# EAGLE design Panda (EAGLE 9.2.2)
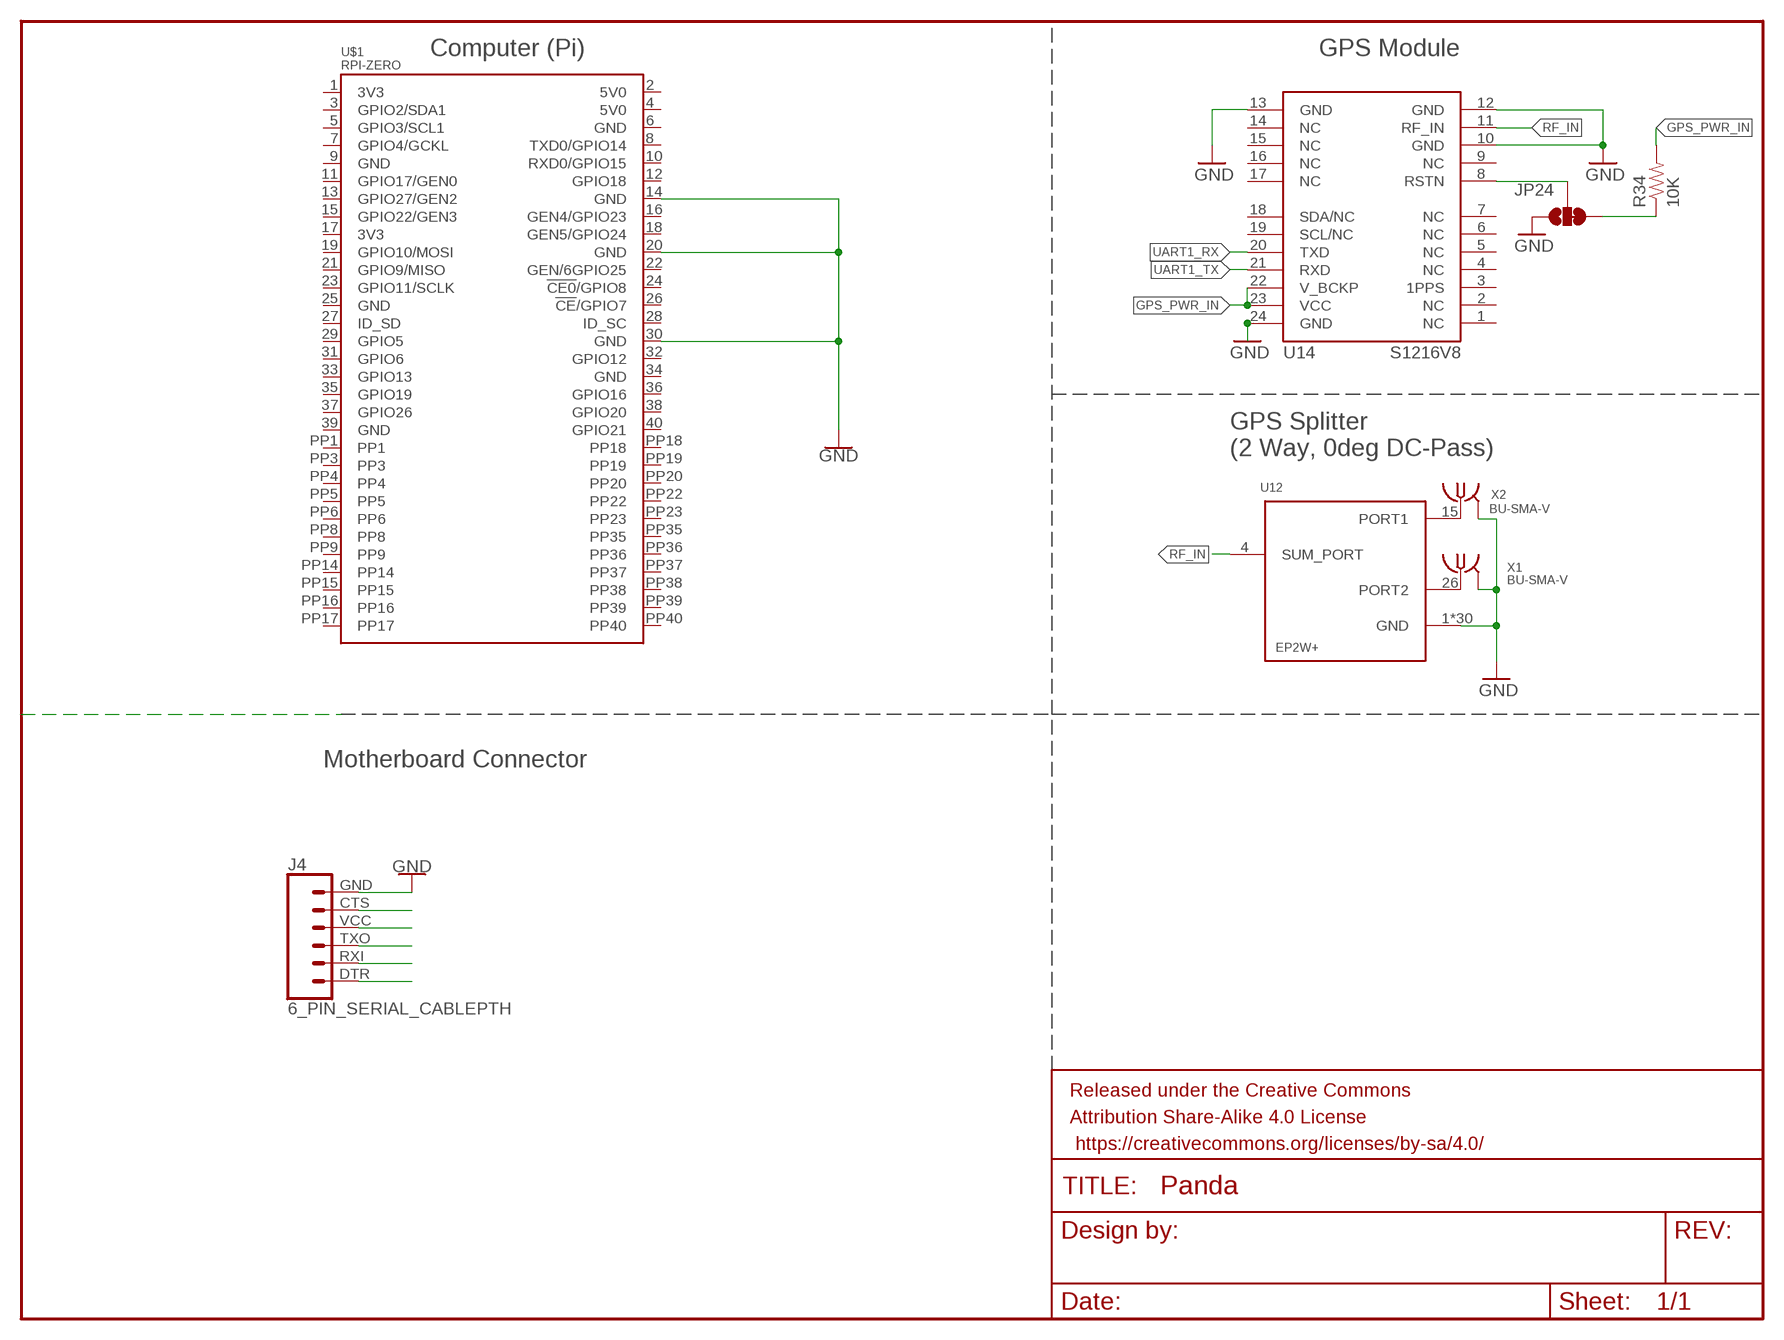
[diagram p0: schematic, sheet 1]

## Parts
FRAME2  FRAME-LETTER  [CREATIVE_COMMONS]
J4  6_PIN_SERIAL_CABLEPTH  [FTDI_BASIC]
JP24  JUMPER-PAD-3-2OF3_NC_BY_TRACE_SMALL  [PAD-JUMPER-3-2OF3_NC_BY_TRACE_YES_SILK_FULL_BOX]
R34  10K  10KOHM-1/10W-1%(0603)0603  [0603-RES]
U12  EP2W+  [QFN32-5X5MM]
U14  S1216V8  [S1216_24PIN_PACKAGE]
U$1  RPI-ZERO  [RASP_PI_ZERO_BOARD_FULL]
X1  BU-SMA-V  [BU-SMA-V]
X2  BU-SMA-V  [BU-SMA-V]

## Nets
GND: J4.GND JP24.1 U12.1(GND) U12.2(GND) U12.3(GND) U12.5(GND) U12.6(GND) U12.7(GND) U12.8(GND) U12.9(GND) U12.10(GND) U12.11(GND) U12.12(GND) U12.13(GND) U12.14(GND) U12.16(GND) U12.17(GND) U12.18(GND) U12.19(GND) U12.20(GND) U12.21(GND) U12.22(GND) U12.23(GND) U12.24(GND) U12.25(GND) U12.27(GND) U12.28(GND) U12.29(GND) U12.30(GND) U12.31(GND) U12.32(GND) U12.EP(GND) U14.10(GND) U14.12(GND) U14.13(GND) U14.24(GND) X1.2 X1.3 X1.4 X1.5 X2.2 X2.3 X2.4 X2.5
GND@6: U$1.14(GND) U$1.20(GND) U$1.30(GND) ; supply symbol labelled GND
GPS_PWR_IN: R34.2 U14.22(V_BCKP) U14.23(VCC)
N$2: J4.CTS
N$3: J4.VCC
N$4: J4.TXO
N$6: J4.RXI
N$7: J4.DTR
N$9: JP24.2 U14.8(RSTN)
N$16: U12.15(PORT1) X2.1
N$17: U12.26(PORT2) X1.1
N$24: JP24.3 R34.1
RF_IN: U12.4(SUM_PORT) U14.11(RF_IN)
UART1_RX: U14.20(TXD)
UART1_TX: U14.21(RXD)
Unconnected: U14.1(NC) U14.2(NC) U14.3(1PPS) U14.4(NC) U14.5(NC) U14.6(NC) U14.7(NC) U14.9(NC) U14.14(NC) U14.15(NC) U14.16(NC) U14.17(NC) U14.18(SDA/NC) U14.19(SCL/NC) U$1.1(3V3) U$1.2(5V0) U$1.3(GPIO2/SDA1) U$1.4(5V0) U$1.5(GPIO3/SCL1) U$1.6(GND) U$1.7(GPIO4/GCKL) U$1.8(TXD0/GPIO14) U$1.9(GND) U$1.10(RXD0/GPIO15) U$1.11(GPIO17/GEN0) U$1.12(GPIO18) U$1.13(GPIO27/GEN2) U$1.15(GPIO22/GEN3) U$1.16(GEN4/GPIO23) U$1.17(3V3) U$1.18(GEN5/GPIO24) U$1.19(GPIO10/MOSI) U$1.21(GPIO9/MISO) U$1.22(GEN/6GPIO25) U$1.23(GPIO11/SCLK) U$1.24(!CE0!/GPIO8) U$1.25(GND) U$1.26(!CE!/GPIO7) U$1.27(ID_SD) U$1.28(ID_SC) U$1.29(GPIO5) U$1.31(GPIO6) U$1.32(GPIO12) U$1.33(GPIO13) U$1.34(GND) U$1.35(GPIO19) U$1.36(GPIO16) U$1.37(GPIO26) U$1.38(GPIO20) U$1.39(GND) U$1.40(GPIO21) U$1.PP1 U$1.PP3 U$1.PP4 U$1.PP5 U$1.PP6 U$1.PP8 U$1.PP9 U$1.PP14 U$1.PP15 U$1.PP16 U$1.PP17 U$1.PP18 U$1.PP19 U$1.PP20 U$1.PP22 U$1.PP23 U$1.PP35 U$1.PP36 U$1.PP37 U$1.PP38 U$1.PP39 U$1.PP40

## Notes on the sheet
- Computer (Pi) | GPS Module
- GPS Splitter 
  (2 Way, 0deg DC-Pass)
- Motherboard Connector
- Modifications are currently needed
  to the module for radiation tolerance

## Library data of the parts
FRAME2 = SparkFun-Aesthetics:FRAME-LETTER: Schematic Frame - Letter Standard 8.5x11 US Letter frame
J4 = SparkFun-Connectors:6_PIN_SERIAL_CABLE: 6-pin header connection for use with the "FTDI BASIC" pinout - CABLE SIDE. Also known as "Arduino Serial Program Header". This is used on a design to provide a 6-pin connection point for serial communication usually from a USB cable (D+/D-) to these headers (RX/TX). It also has the remaining pins necessary for programming in the Arduino evironment (DTR, GND, and sometimes VCC). Note, this device has "CABLE" in the name. It is intended to be used on a design that usually lives on the end of your USB cable and prvides the converter chip (FTDI232 or FTDI231x) to commnicate serial RX/TX. The "sister" device, named "TARGET" is inteneded to be used on a design that contains a target micro-controller that you wish to program. You can populate with some of these: Female Headers <https://www.sparkfun.com/products/115> (PRT-00115) For reference (or to suit your programming needs) check out these designs: SparkFun FTDI Basic Breakout - 5V <https://www.sparkfun.com/products/9716> (DEV-09716) SparkFun FTDI Basic Breakout - 3.3V <https://www.sparkfun.com/products/9873> (DEV-09873) SparkFun FTDI SmartBasic <https://www.sparkfun.com/products/12935> (DEV-12935) SparkFun Beefy 3 - FTDI Basic Breakout <https://www.sparkfun.com/products/13746> (DEV-13746)
JP24 = SparkFun-Passives:JUMPER-PAD-3-2OF3_NC_BY_TRACE
R34 = SparkFun-Resistors:10KOHM-1/10W-1%(0603): RES-00824; PROD_ID: RES-00824
U12 = maholli:EP2W+
U14 = maholli:S1216V8
U$1 = rpi-zero:RPI-ZERO
X1 X2 = con-coax:BU-SMA-V: FEMALE SMA CONNECTOR Radiall distributor RS 112-3794; OC_FARNELL: unknown; OC_NEWARK: unknown

## Net classes
0 default: width 0.272 mm, drill 0.381 mm, clearance 0.127 mm

## Board
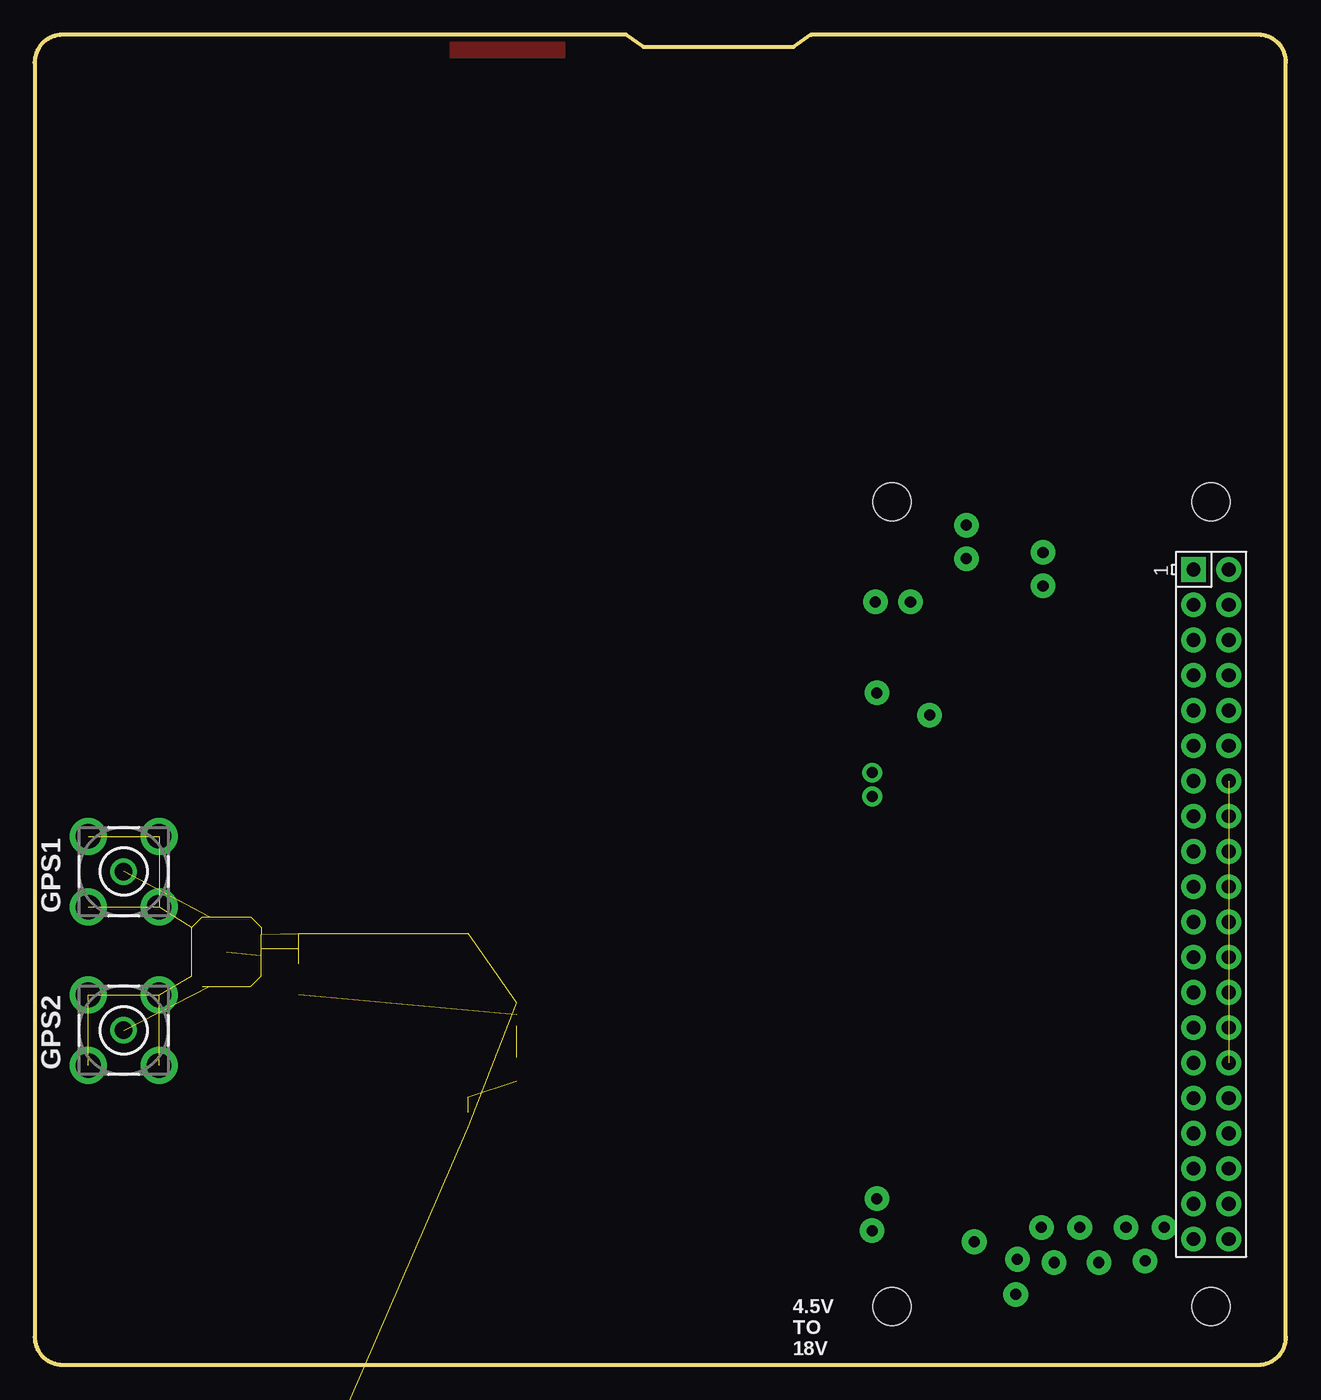
[diagram p1: board, top side]
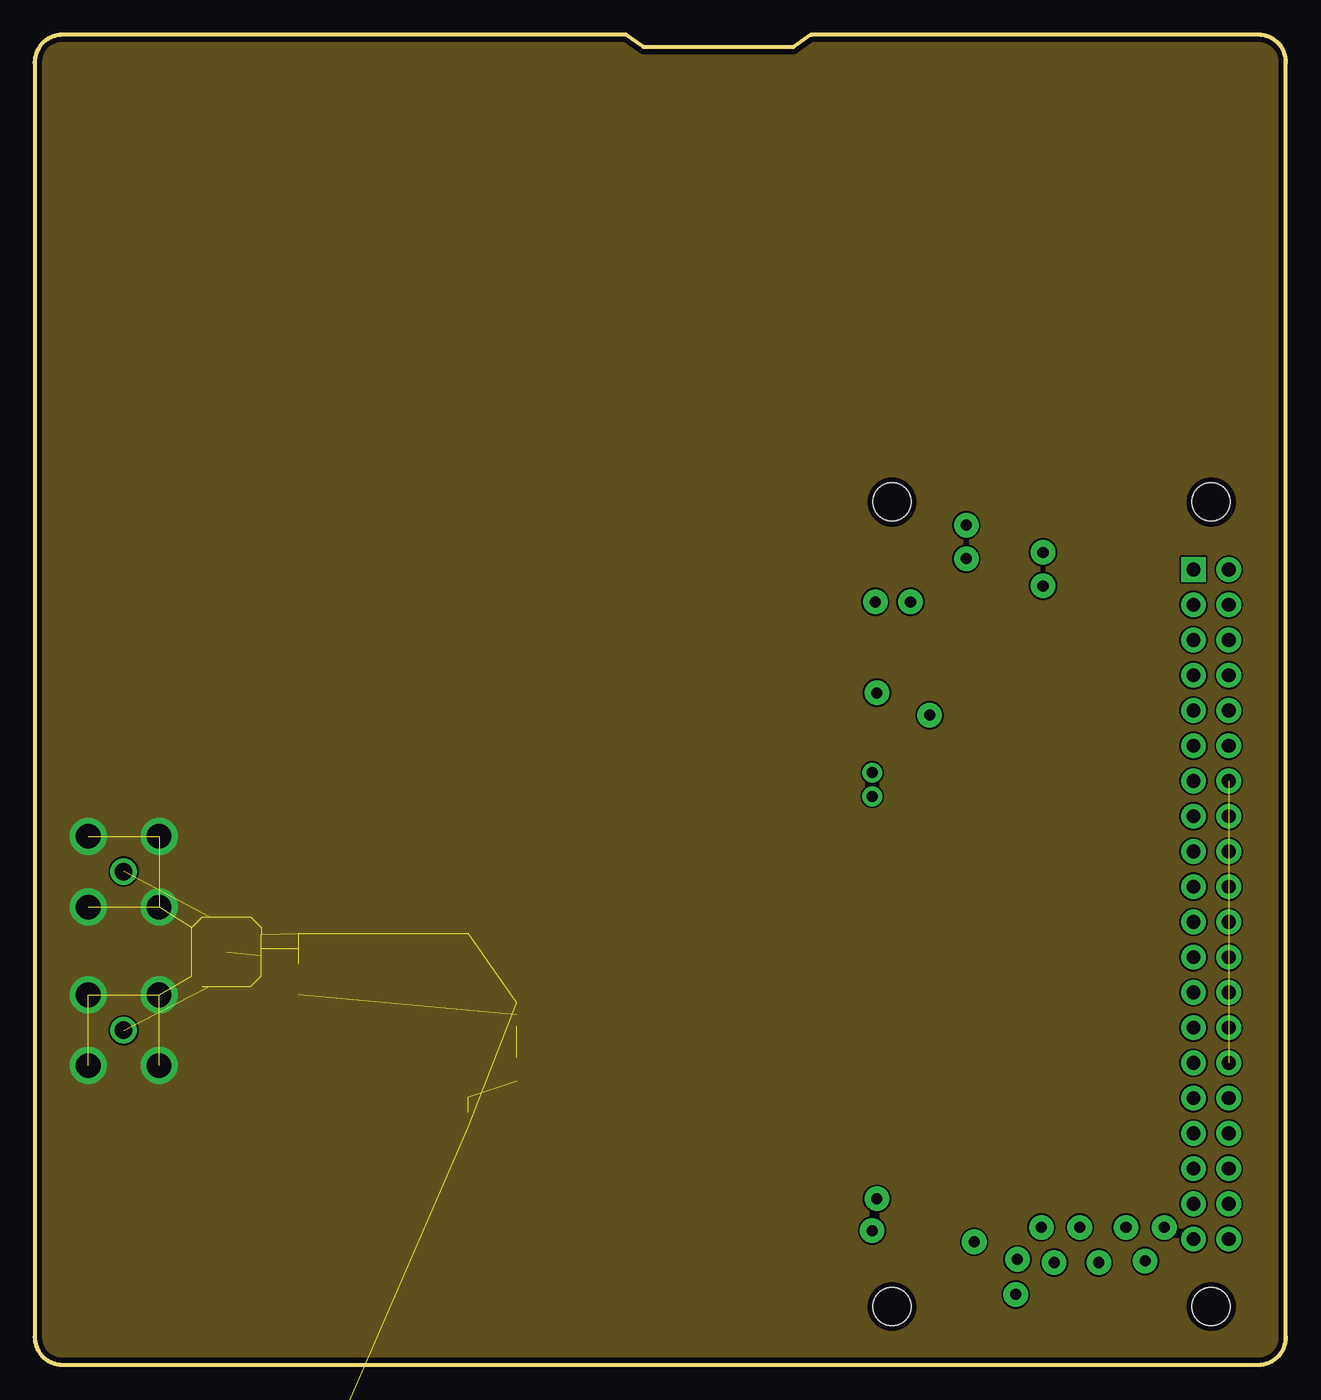
[diagram p2: board, inner layer Route2]
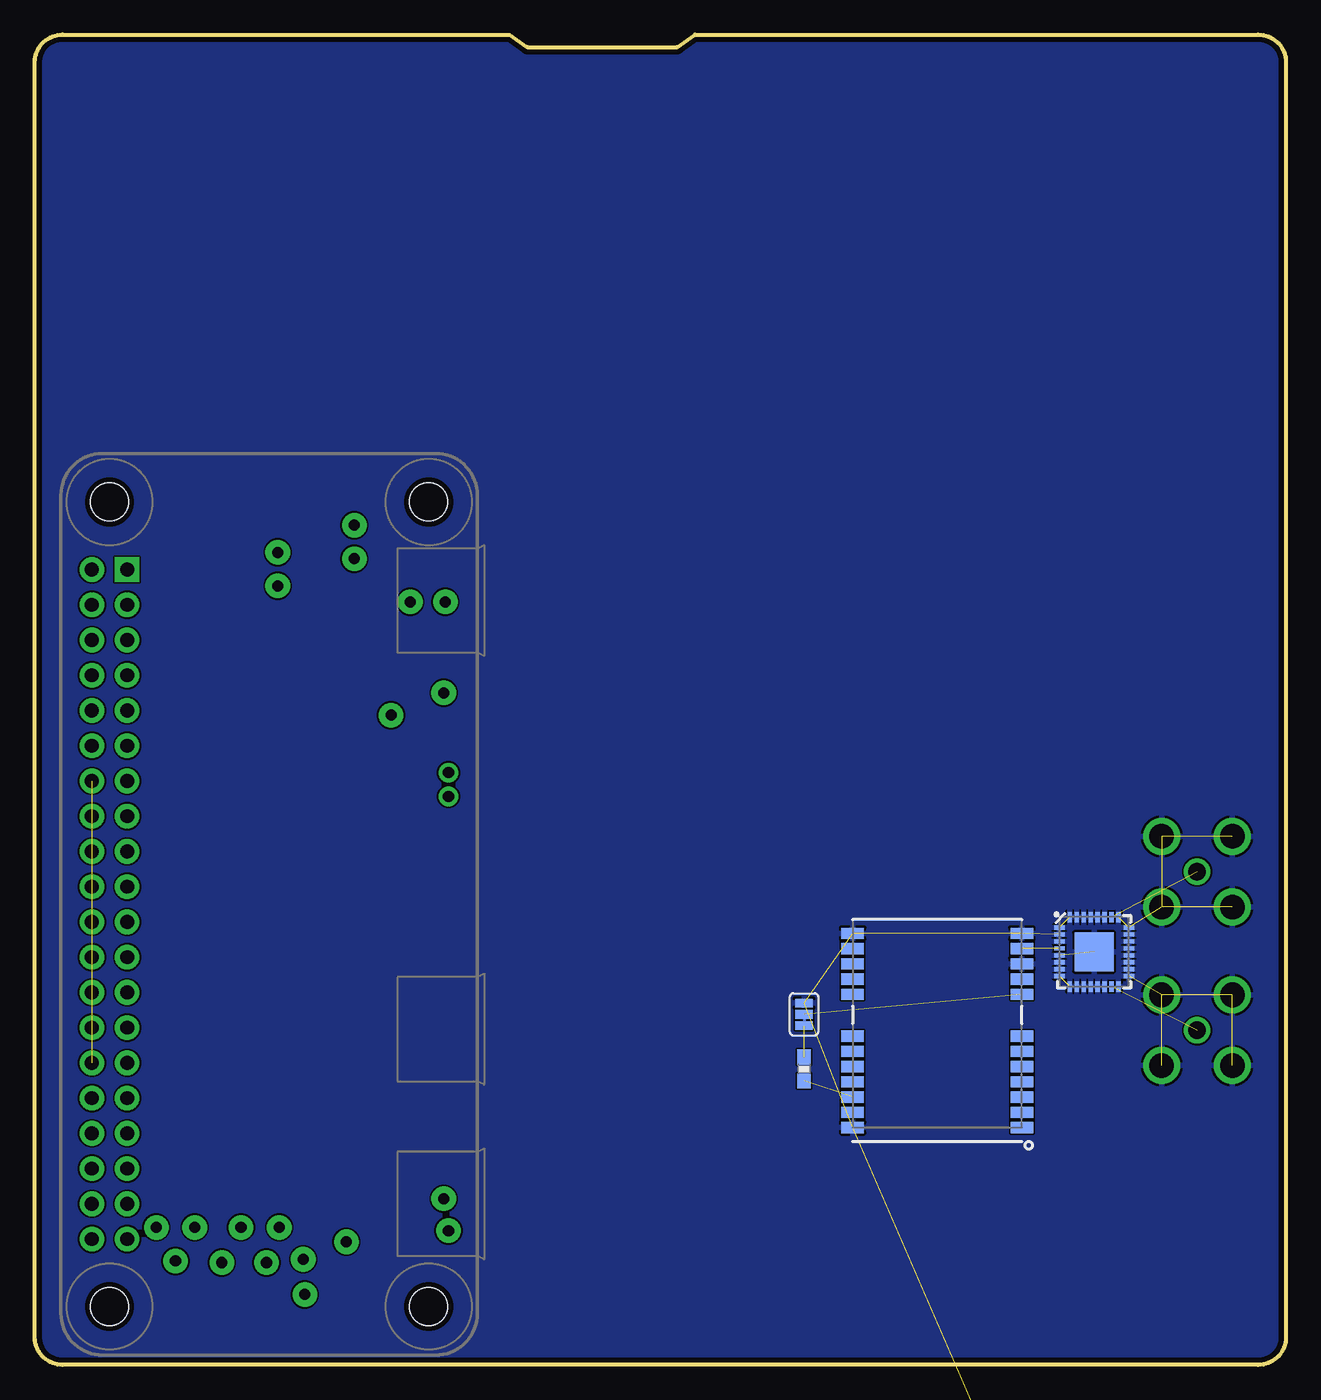
[diagram p3: board, bottom side, seen from below]

Size 90.17 x 95.89 mm. Coordinates in mm from the lower left corner, seen from the top.
Outline: 0,93.89 0,2 arc90 2,0 88.17,0 arc90 90.17,2 90.17,93.89 arc90 88.17,95.89 55.94,95.88 54.67,94.99 43.88,94.99 42.59,95.89 2,95.89 arc90 0,93.89
Copper layers (1*2*15*16): Top 0.035559375mm / dielectric 0.17018125mm / Route2 0.01778125mm / dielectric 47mil / Route15 0.01778125mm / dielectric 0.17018125mm / Bottom 0.035559375mm
Design rules "oshpark-4layer *": minimum track width 5mil, minimum drill 10mil, track to track 5mil, track to pad 5mil, pad to pad 5mil, via to via 5mil, smd to smd 5mil, copper to edge 15mil, drill to drill 6mil, minimum pad ring 4mil, minimum via ring 4mil, stop-mask expansion 2.5mil, vias tented up to drill 0mil, thermal gap 7mil

### Footprints (pad centres in the part's own frame; a part is rotated, then mirrored left to right if it is on the bottom)
FTDI_BASIC = drill 1.016 pad 1.88: CTS 10.16,0; DTR 0,0; GND 12.7,0; RXI 2.54,0; TXO 5.08,0; VCC 7.62,0
PAD-JUMPER-3-2OF3_NC_BY_TRACE_YES_SILK_FULL_BOX = smd 0.635 x 1.27: 1 -0.813,0; 2 0,0; 3 0.813,0
0603-RES = smd 1.1 x 1: 1 -0.85,0; 2 0.85,0
QFN32-5X5MM = smd 0.762 x 0.305: 1 -2.5,1.75; 2 -2.5,1.25; 3 -2.5,0.75; 4 -2.5,0.25; 5 -2.5,-0.25; 6 -2.5,-0.75; 7 -2.5,-1.25; 8 -2.5,-1.75; 17 2.5,-1.75; 18 2.5,-1.25; 19 2.5,-0.75; 20 2.5,-0.25; 21 2.5,0.25; 22 2.5,0.75; 23 2.5,1.25; 24 2.5,1.75 | smd 0.305 x 0.762: 9 -1.75,-2.5; 10 -1.25,-2.5; 11 -0.75,-2.5; 12 -0.25,-2.5; 13 0.25,-2.5; 14 0.75,-2.5; 15 1.25,-2.5; 16 1.75,-2.5; 25 1.75,2.5; 26 1.25,2.5; 27 0.75,2.5; 28 0.25,2.5; 29 -0.25,2.5; 30 -0.75,2.5; 31 -1.25,2.5; 32 -1.75,2.5 | smd 2.794 x 2.794: EP 0,0
S1216_24PIN_PACKAGE = smd 1.626 x 0.813: 1 5.85,-7.62; 2 5.85,-6.52; 3 5.85,-5.42; 4 5.85,-4.32; 5 5.85,-3.22; 6 5.85,-2.12; 7 5.85,-1.02; 8 5.85,1.98; 9 5.85,3.08; 10 5.85,4.18; 11 5.85,5.28; 12 5.85,6.38; 13 -6.35,6.38; 14 -6.35,5.28; 15 -6.35,4.18; 16 -6.35,3.08; 17 -6.35,1.98; 18 -6.35,-1.02; 19 -6.35,-2.12; 20 -6.35,-3.22; 21 -6.35,-4.32; 22 -6.35,-5.42; 23 -6.35,-6.52; 24 -6.35,-7.62
RASP_PI_ZERO_BOARD_FULL = drill 1 pad 1.778 square: 1 8.37,25.23 | drill 1 pad 1.778: 2 8.37,27.77; 3 10.91,25.23; 4 10.91,27.77; 5 13.45,25.23; 6 13.45,27.77; 7 15.99,25.23; 8 15.99,27.77; 9 18.53,25.23; 10 18.53,27.77; 11 21.07,25.23; 12 21.07,27.77; 13 23.61,25.23; 14 23.61,27.77; 15 26.15,25.23; 16 26.15,27.77; 17 28.69,25.23; 18 28.69,27.77; 19 31.23,25.23; 20 31.23,27.77; 21 33.77,25.23; 22 33.77,27.77; 23 36.31,25.23; 24 36.31,27.77; 25 38.85,25.23; 26 38.85,27.77; 27 41.39,25.23; 28 41.39,27.77; 29 43.93,25.23; 30 43.93,27.77; 31 46.47,25.23; 32 46.47,27.77; 33 49.01,25.23; 34 49.01,27.77; 35 51.55,25.23; 36 51.55,27.77; 37 54.09,25.23; 38 54.09,27.77; 39 56.63,25.23; 40 56.63,27.77 | drill 0.8 pad 1.778: PP1 10.699,4.832; PP3 7.593,8.858; PP4 7.133,14.38; PP5 55.796,23.124; PP6 10.699,2.301; PP8 5.177,8.858; PP9 9.549,14.38; PP14 58.327,18.407; PP15 55.796,14.265; PP16 55.796,20.363; PP17 58.212,21.743; PP18 55.796,17.027; PP19 58.327,15.186; PP20 56.832,9.434; PP35 17.257,2.416; PP36 60.628,12.425; PP37 56.026,2.071; PP38 53.726,2.416; PP39 58.097,12.54; PP40 18.867,6.212 | drill 0.8 pad 1.422: PP22 23.009,2.071; PP23 24.734,2.071 | hole 2.75: 3.5,3.5; 3.5,26.5; 61.5,3.5; 61.5,26.5
BU-SMA-V = drill 1.27: 1 0,0 | drill 1.778: 2 -2.55,2.55; 3 2.55,2.55; 4 2.55,-2.55; 5 -2.55,-2.55

### Placement (x,y rotation side)
FRAME2  20.58,-16.7 0 top  (outside the outline)
J4  1.05,-23.2 0 top  (outside the outline)
JP24  34.73,25.26 270 bottom
R34  34.73,21.33 270 bottom
U12  13.83,29.77 0 bottom
U14  24.88,24.72 0 bottom
U$1  58.28,65.7 270 top
X1  6.41,35.55 270 top
X2  6.41,24.12 270 top

### Tracks (layer width: path | path; a pad name or v marks a point on that pad's centre or on a via)
GND  (43 unrouted)
  pour Bottom (rank 2): 2,95.89 42.6,95.89 43.88,94.99 54.67,94.99 55.94,95.88 88.17,95.89 arc-90 90.17,93.89 90.17,2 arc-90 88.17,0 2,0 arc-90 0,2 0,93.89 arc-90
  pour Route2 (no thermals): 2,95.89 42.6,95.89 43.88,94.99 54.67,94.99 55.94,95.88 88.17,95.89 arc-90 90.17,93.89 90.17,2 arc-90 88.17,0 2,0 arc-90 0,2 0,93.89 arc-90
  pour Bottom (no thermals): 30.03,95.75 38.16,95.75 38.16,94.48 30.03,94.48
GND@6  (2 unrouted)
GPS_PWR_IN  (2 unrouted)
N$9  (1 unrouted)
N$16  (1 unrouted)
N$17  (1 unrouted)
N$24  (1 unrouted)
RF_IN  (1 unrouted)
VSOLAR
  pour Top (no thermals): 30.03,95.75 38.16,95.75 38.16,94.22 30.03,94.22

### Text on the board
tNames: GPS1 | GPS2 | 4.5V / TO / 18V
Document: Passive grid = 10mils / IC grid = 50 mils / Fanout grid = 2mil RFM,